# EAGLE design cat4101-bare (EAGLE 7.2.0)
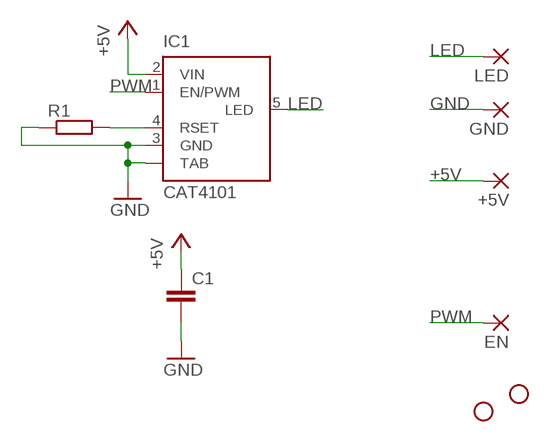
[diagram p0: schematic, sheet 1]

## Parts
+5V  SMD2  [SMD1,27-2,54]
C1  C-EUC0805K  [C0805K]
EN  SMD2  [SMD1,27-2,54]
GND  SMD5  [SMD2,54-5,08]
IC1  CAT4101  [TO263_5]
JP1  STAND-OFF  [STAND-OFF]
JP2  STAND-OFF  [STAND-OFF]
LED  SMD5  [SMD2,54-5,08]
R1  R-EU_R0805  [R0805]

## Nets
+5V: +5V.1(P) C1.1 IC1.2(VIN)
GND: C1.2 GND.1(P) IC1.3(GND) IC1.TAB R1.1
LED: IC1.5(LED) LED.1(P)
N$1: IC1.4(RSET) R1.2
PWM: EN.1(P) IC1.1(EN/PWM)

## Library data of the parts
+5V EN = wirepad:SMD2: SMD PAD
C1 = rcl:C-EU: CAPACITOR, European symbol
GND LED = wirepad:SMD5: SMD PAD
IC1 = on-semiconductor:CAT4101: 1A Constant-Current LED Driver with PWM Dimming Source: ON Semiconductor .. 4101.pdf; MPN: CAT4101TV-T75; OC_FARNELL: 1718452; OC_NEWARK: 08R5264
JP1 JP2 = Pinoccio:STAND-OFF: Stand Off This is the mechanical footprint for a #4 phillips button head screw. Use the keepout ring to avoid running the screw head into surrounding components. SKU : PRT-00447
R1 = rcl:R-EU_: RESISTOR, European symbol

## Board
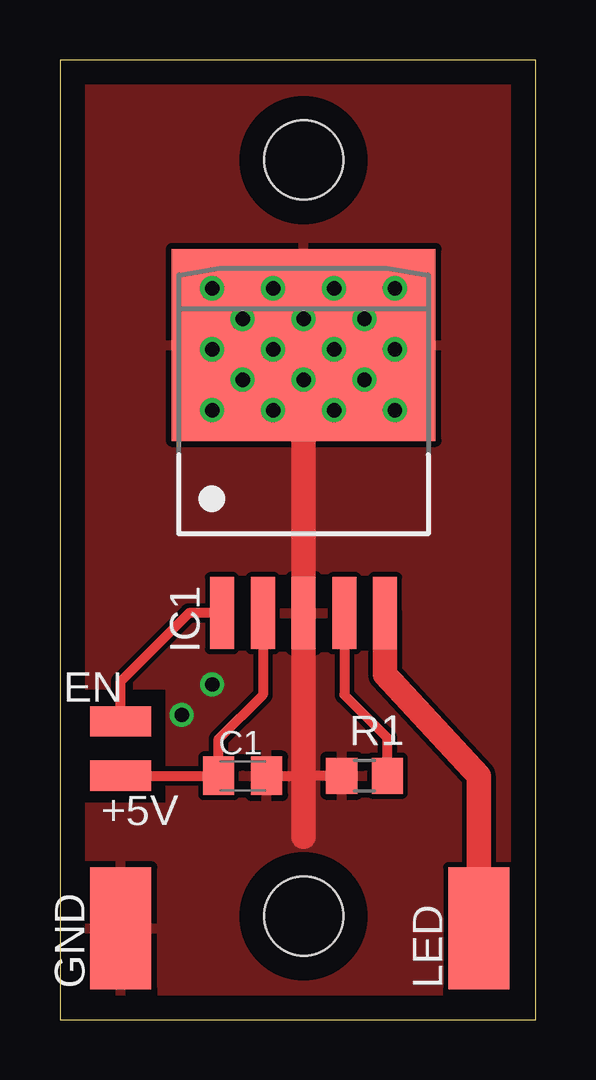
[diagram p1: board, top side]
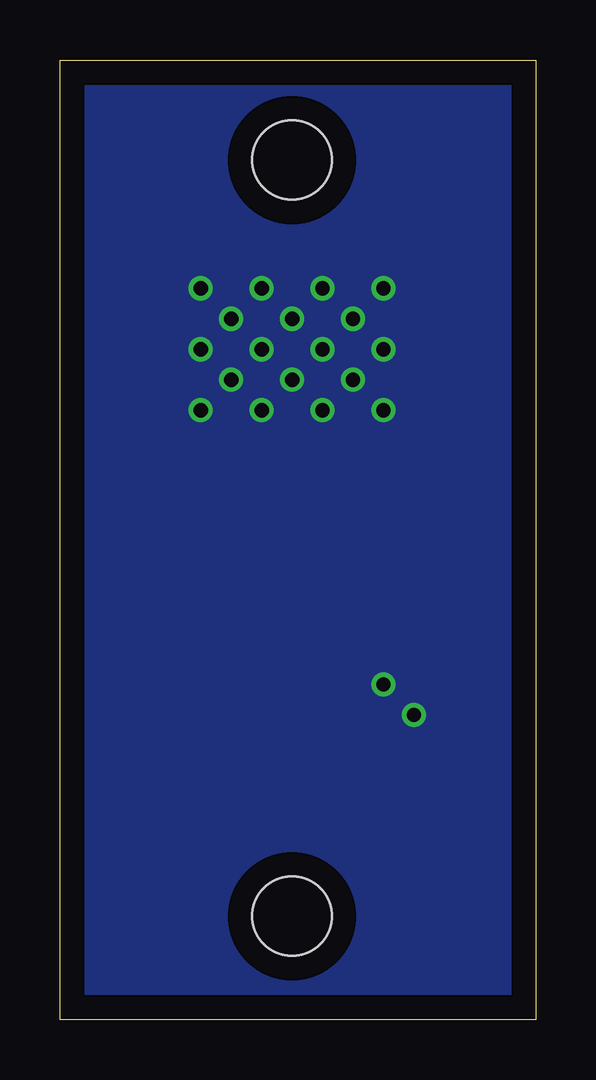
[diagram p2: board, bottom side, seen from below]

Size 19.84 x 40 mm. Coordinates in mm from the lower left corner, seen from the top.
Outline: 0,0 19.84,0 19.84,40 0,40 0,0
Copper layers (1*16): Top 0.035mm / dielectric 1.5mm / Bottom 0.035mm
Design rules "default": minimum track width 10mil, minimum drill 24mil, track to track 8mil, track to pad 8mil, pad to pad 8mil, via to via 8mil, smd to smd 8mil, copper to edge 40mil, drill to drill 8mil, minimum pad ring 10mil, minimum via ring 8mil, stop-mask expansion 4mil, vias tented up to drill 0mil, thermal gap 10mil
tRestrict: area 0.6,9.1 to 4.4,13.8

### Footprints (pad centres in the part's own frame; a part is rotated, then mirrored left to right if it is on the bottom)
SMD1,27-2,54 = smd 1.27 x 2.54: 1 0,0
C0805K = smd 1.3 x 1.6: 1 -1,0; 2 1,0
SMD2,54-5,08 = smd 2.54 x 5.08: 1 0,0
TO263_5 = smd 1 x 3: 1 -3.4,-8; 2 -1.7,-8; 3 0,-8; 4 1.7,-8; 5 3.4,-8 | smd 11 x 8: TAB 0,3.175
STAND-OFF = hole 3.302: 0,0
R0805 = smd 1.3 x 1.5: 1 -0.95,0; 2 0.95,0

### Placement (x,y rotation side)
+5V  2.54,10.16 90 top
C1  7.62,10.16 0 top
EN  2.54,12.43 270 top
GND  2.54,3.81 0 top
IC1  10.16,24.94 0 top
JP1  10.16,35.83 0 top
JP2  10.16,4.31 0 top
LED  17.47,3.81 0 top
R1  12.7,10.16 0 top

### Tracks (layer width: path | path; a pad name or v marks a point on that pad's centre or on a via)
+5V
  Top 0.406: IC1.2 8.46,13.54 6.62,11.7 C1.1 +5V.1
GND  (via drill 0.6)
  Top 0.406: C1.2 10.16,10.16 R1.1
  Top 1.016: IC1.TAB v10.16,26.67 IC1.3 10.16,10.16 10.16,7.62
  other vias: 6.35,25.4 7.62,26.67 8.89,25.4 11.43,25.4 13.97,25.4 12.7,26.67 13.97,27.94 11.43,27.94 12.7,29.21 13.97,30.48 11.43,30.48 10.16,29.21 8.89,27.94 6.35,27.94 7.62,29.21 8.89,30.48 6.35,30.48 5.08,12.7 6.35,13.97
  pour Bottom: -1.27,41.91 21.59,41.91 22.86,-1.27 -1.27,-1.27
  pour Top: 0,40.64 20.32,39.37 20.32,-2.54 0,-1.27
LED
  Top 1.016: IC1.5 13.56,14.38 17.47,10.16 LED.1
N$1
  Top 0.406: IC1.4 11.86,13.54 13.65,11.75 R1.2
PWM
  Top 0.406: EN.1 2.54,14.1 5.38,16.94 IC1.1